# EAGLE design Anand1-BottomNew (EAGLE 9.5.2)
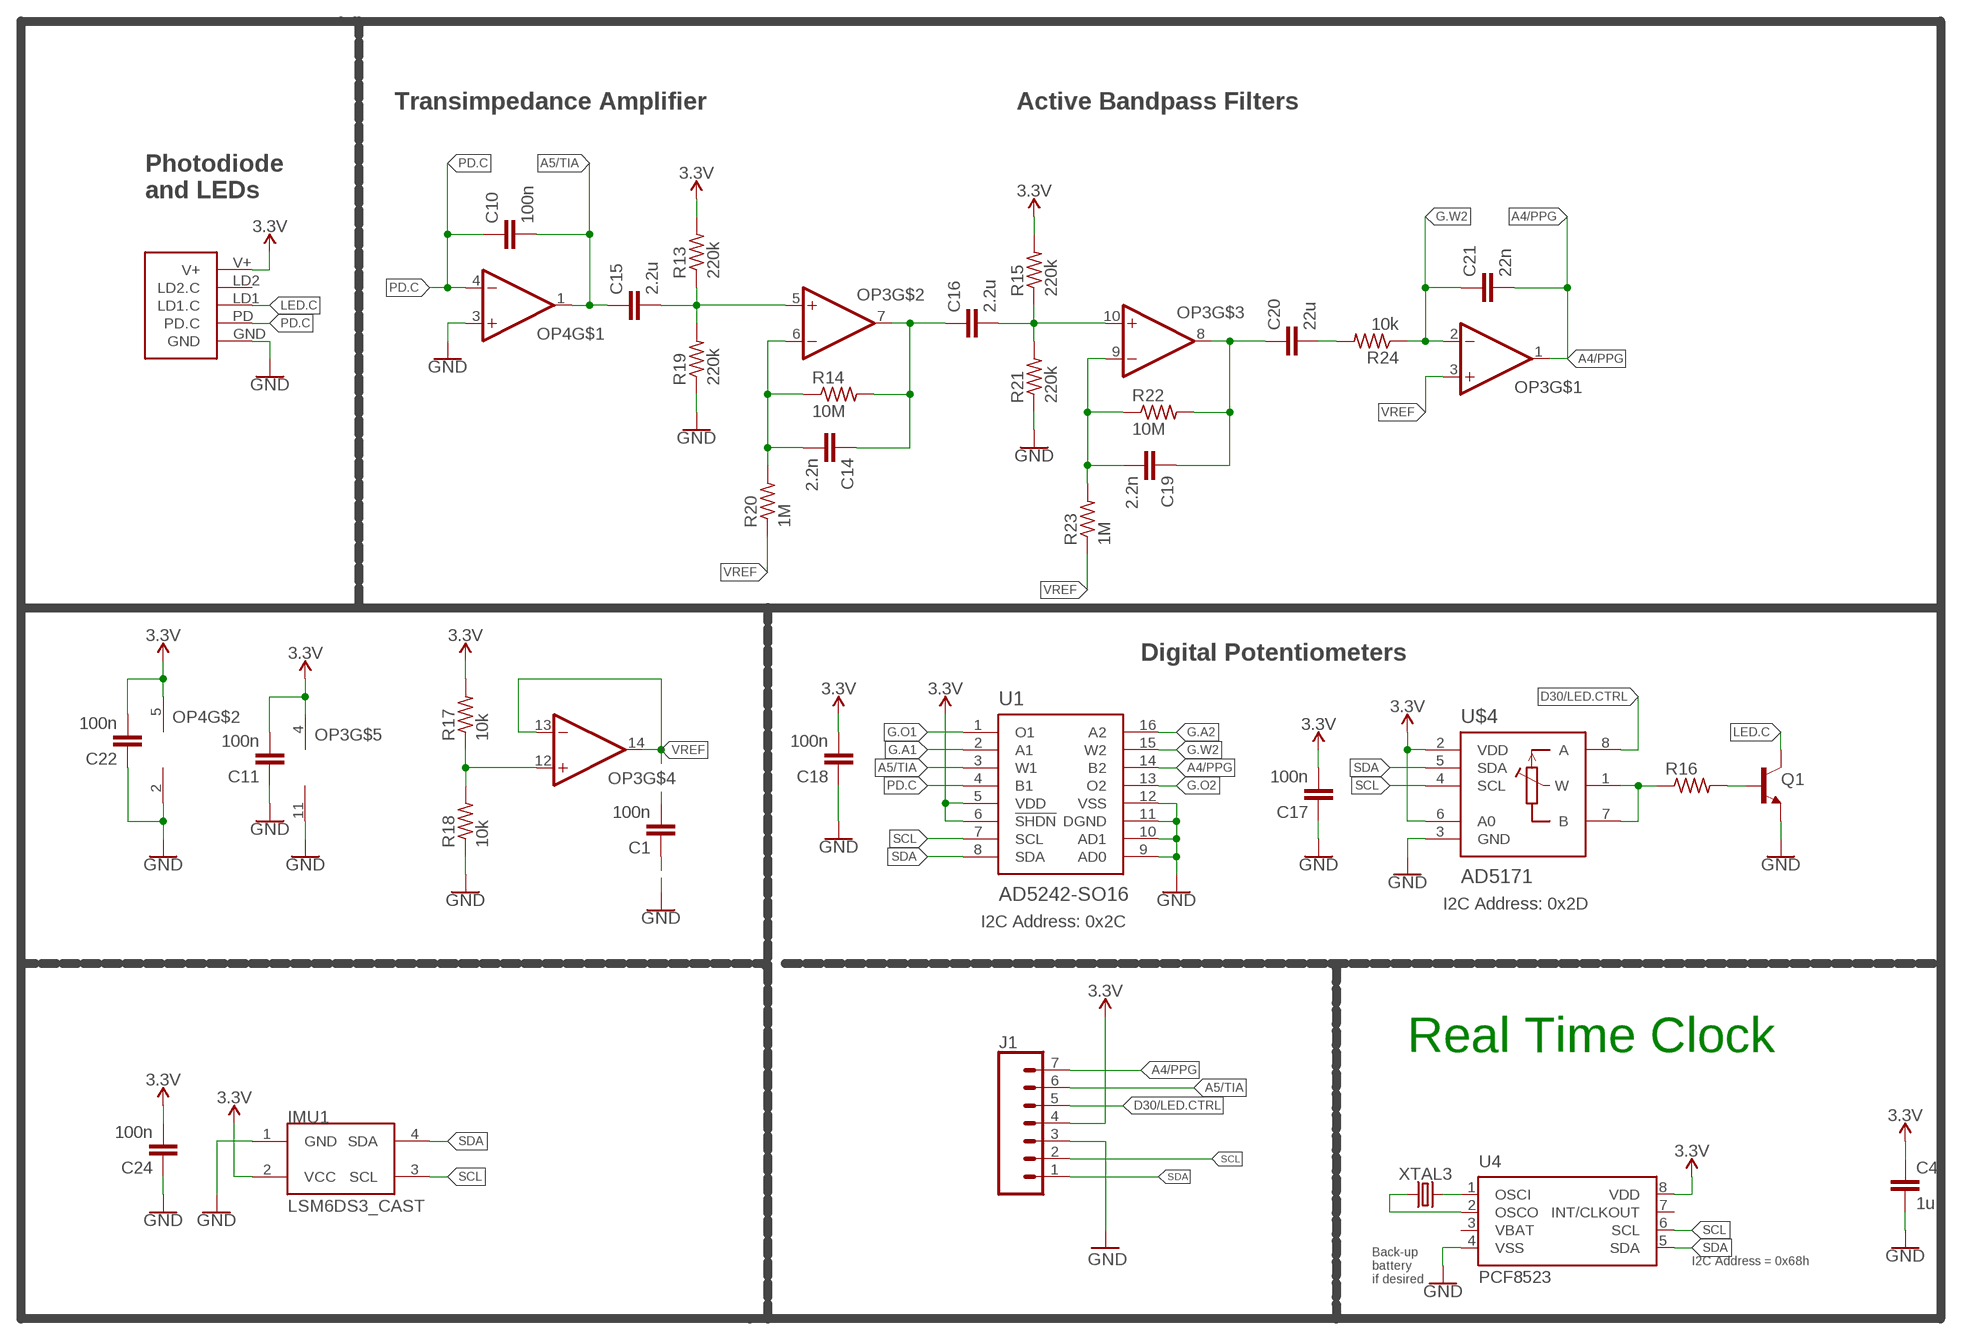
[diagram p0: schematic, sheet 1]

## Parts
C1  100n  CAPACITOR0603  [C0603]
C4  1u  CAPACITOR0603  [C0603]
C10  100n  CAPACITOR0603  [C0603]
C11  100n  CAPACITOR0603  [C0603]
C14  2.2n  CAPACITOR0603  [C0603]
C15  2.2u  CAPACITOR0603  [C0603]
C16  2.2u  CAPACITOR0603  [C0603]
C17  100n  CAPACITOR0603  [C0603]
C18  100n  CAPACITOR0603  [C0603]
C19  2.2n  CAPACITOR0603  [C0603]
C20  22u  CAPACITOR0603  [C0603]
C21  22n  CAPACITOR0603  [C0603]
C22  100n  CAPACITOR0603  [C0603]
C24  100n  CAPACITOR0603  [C0603]
IMU1  LSM6DS3_CAST  [LSM6DS3_CAST]
J1  CONN_07-1.27MM  [1X07_1.27MM]
OP3  OP-QUAD-SO14  [SO14]
OP4  OP-SINGLEOT  [SOT23-5]
Q1  NPN-GENERIC  [SOT23-3]
R13  220k  RESISTOR0603  [R0603]
R14  10M  RESISTOR0603  [R0603]
R15  220k  RESISTOR0603  [R0603]
R16  RESISTOR0603  [R0603]
R17  10k  RESISTOR0402  [R0402]
R18  10k  RESISTOR0402  [R0402]
R19  220k  RESISTOR0603  [R0603]
R20  1M  RESISTOR0603  [R0603]
R21  220k  RESISTOR0603  [R0603]
R22  10M  RESISTOR0603  [R0603]
R23  1M  RESISTOR0603  [R0603]
R24  10k  RESISTOR0603  [R0603]
U1  AD5242-SO16  [SO16]
U4  PCF8523  [SO8]
U$3  PPG.MODULE.2  [PPG.MODULE.2]
U$4  AD5171  [SOT-23-8]
XTAL3  32.7680kHz  CRYSTALECS-.327-12.5-12-C-TR  [2-SMD.NOLEAD.2.0MMTO1.2MM]

## Nets
3.3V: C4.1 C11.2 C17.2 C18.2 C22.2 C24.2 IMU1.2(VCC) J1.4 OP3.4(V+) OP4.5(V+) R13.2 R15.2 R17.2 U1.5(VDD) U1.6(!SHDN) U4.8(VDD) U$3.V+ U$4.2(VDD) U$4.6(A0)
A4/PPG: C21.2 J1.7 OP3.1(OUT) U1.14(B2)
A5/TIA: C10.2 C15.1 J1.6 OP4.1(OUT) U1.3(W1)
D30/LED.CTRL: J1.5 U$4.8(A)
G.A1: U1.2(A1)
G.A2: U1.16(A2)
G.O1: U1.1(O1)
G.O2: U1.13(O2)
G.W2: C21.1 OP3.2(-IN) R24.1 U1.15(W2)
GND: C1.1 C4.2 C11.1 C17.1 C18.1 C22.1 C24.1 IMU1.1(GND) J1.3 OP3.11(V-) OP4.2(V-) OP4.3(+IN) Q1.2(E) R18.1 R19.1 R21.1 U1.9(AD0) U1.10(AD1) U1.11(DGND) U1.12(VSS) U4.4(VSS) U$3.GND U$4.3(GND)
LED.C: Q1.3(C) U$3.LD1(LD1.C)
N$2: U4.2(OSCO) XTAL3.P$1
N$3: U4.1(OSCI) XTAL3.P$2
N$8: Q1.1(B) R16.2
N$9: R16.1 U$4.1(W) U$4.7(B)
N$10: OP3.12(+IN) R17.1 R18.2
N$13: C15.2 OP3.5(+IN) R13.1 R19.2
N$15: C14.2 OP3.6(-IN) R14.1 R20.2
N$16: C14.1 C16.1 OP3.7(OUT) R14.2
N$17: C16.2 OP3.10(+IN) R15.1 R21.2
N$18: C19.2 OP3.9(-IN) R22.1 R23.2
N$19: C19.1 C20.1 OP3.8(OUT) R22.2
N$20: C20.2 R24.2
PD.C: C10.1 OP4.4(-IN) U1.4(B1) U$3.PD(PD.C)
SCL: IMU1.3(SCL) J1.2 U1.7(SCL) U4.6(SCL) U$4.4(SCL)
SDA: IMU1.4(SDA) J1.1 U1.8(SDA) U4.5(SDA) U$4.5(SDA)
VREF: C1.2 OP3.3(+IN) OP3.13(-IN) OP3.14(OUT) R20.1 R23.1
Unconnected: U4.7(INT/CLKOUT) U$3.LD2(LD2.C)

## Notes on the sheet
- Transimpedance Amplifier | Active Bandpass Filters
- Photodiode
  and LEDs
- Digital Potentiometers
- I2C Address: 0x2D
- I2C Address: 0x2C
- Real Time Clock
- I2C Address = 0x68h
- Back-up
  battery
  if desired

## Power pins joined to a net without a drawn wire
VBAT: U4.3(VBAT)

## Library data of the parts
C1 C4 C10 C11 C14-C22 C24 = LinnesLab-Passives:CAPACITOR
IMU1 = LinnesLab-Sensors:LSM6DS3_CAST
J1 = LinnesLab-Connectors:CONN_07: Multi connection point. Often used as Generic Header-pin footprint for 0.1 inch spaced/style header connections On any of the 0.1 inch spaced packages, you can populate with these: Break Away Headers - Straight <https://www.sparkfun.com/products/116> (PRT-00116) Break Away Male Headers - Right Angle <https://www.sparkfun.com/products/553> (PRT-00553) Female Headers <https://www.sparkfun.com/products/115> (PRT-00115) Break Away Headers - Machine Pin <https://www.sparkfun.com/products/117> (PRT-00117) Break Away Female Headers - Swiss Machine Pin <https://www.sparkfun.com/products/743> (PRT-00743) For SCREWTERMINALS and SPRING TERMINALS visit here: Screw Terimnals on SparkFun.com <https://www.sparkfun.com/search/results?term=Screw+Terminals> (5mm/3.5mm/2.54mm spacing) This device is also useful as a general connection point to wire up your design to another part of your project. Our various solder wires solder well into these plated through hole pads. Hook-Up Wire - Assortment (Stranded, 22 AWG) <https://www.sparkfun.com/products/11375> (PRT-11375) Hook-Up Wire - Assortment (Solid Core, 22 AWG) <https://www.sparkfun.com/products/11367> (PRT-11367) View the entire wire category on our website here <https://www.sparkfun.com/categories/141> Special notes: Molex polarized connector foot print use with SKU : PRT-08231 with associated crimp pins and housings. 1MM SMD Version SKU: PRT-10208 NOTES ON THE VARIANTS LOCK and LOCK_LONGPADS... This footprint was designed to help hold the alignment of a through-hole component (i.e. 6-pin header) while soldering it into place. You may notice that each hole has been shifted either up or down by 0.005 of an inch from it's more standard position (which is a perfectly straight line). This slight alteration caused the pins (the squares in the middle) to touch the edges of the holes. Because they are alternating, it causes a "brace" to hold the component in place. 0.005 has proven to be the perfect amount of "off-center" position when using our standard breakaway headers. Although looks a little odd when you look at the bare footprint, once you have a header in there, the alteration is very hard to notice. Also,if you push a header all the way into place, it is covered up entirely on the bottom side.
OP3 = LinnesLab-AnalogIC:OP-QUAD: General symbol and footprints for Quad Op Amps. Use with any standard general purpose op amp.
OP4 = LinnesLab-AnalogIC:OP-SINGLE: Single Op Amp 2.7V to 6.0V Single Supply CMOS Source: http://ww1.microchip.com/downloads/en/DeviceDoc/21314g.pdf
Q1 = LinnesLab-DiscreteSemi:NPN
R13-R24 = LinnesLab-Passives:RESISTOR
U1 = LinnesLab-DigitalIC:AD5242
U4 = LinnesLab-Clocks:PCF8523; DIGIKEY: 568-5306-1-ND; I2C_ADDRESS: 0x68h; MFN: PCF8523T/1,118; MFN_MANUFACTURER: NXP USA Inc.
U$3 = LinnesLab-Connectors:PPG.MODULE.2: Digi-Key Part Number: S9014E-50-ND Manufacturer Part Number: GRPB501VWVN-RC Description: 1mm insulation height 0.05in pitch 50 positions
U$4 = LinnesLab-DigitalIC:AD5171
XTAL3 = LinnesLab-Clocks:CRYSTAL

## Board
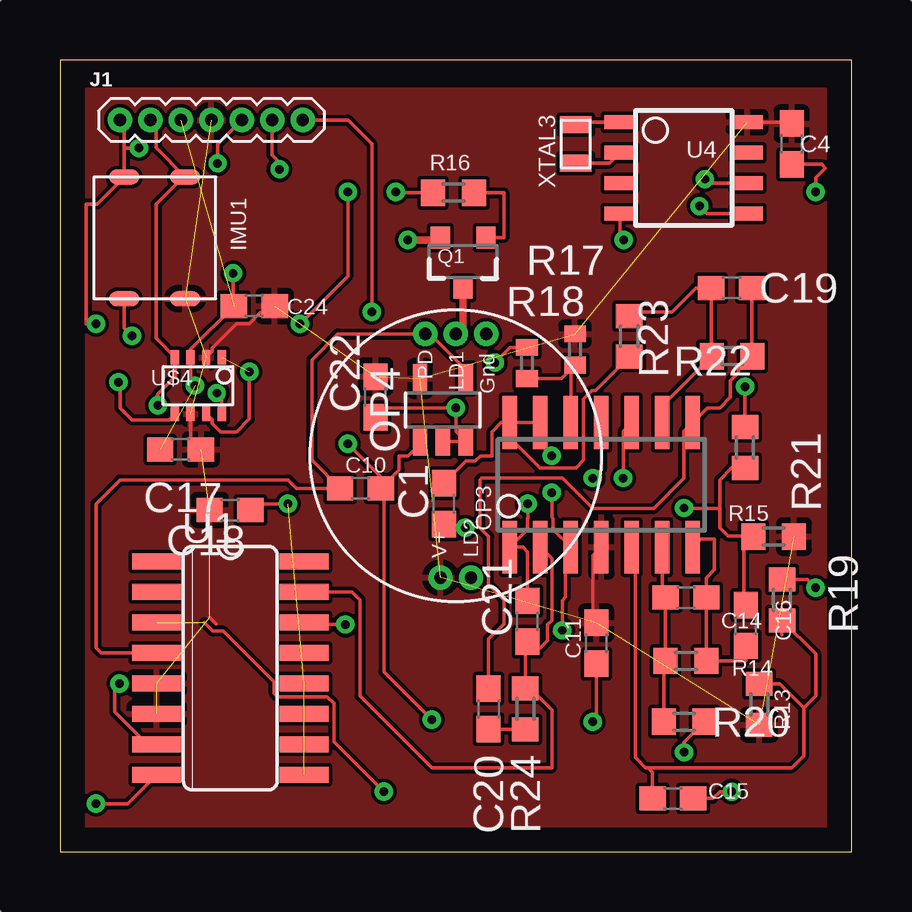
[diagram p1: board, top side]
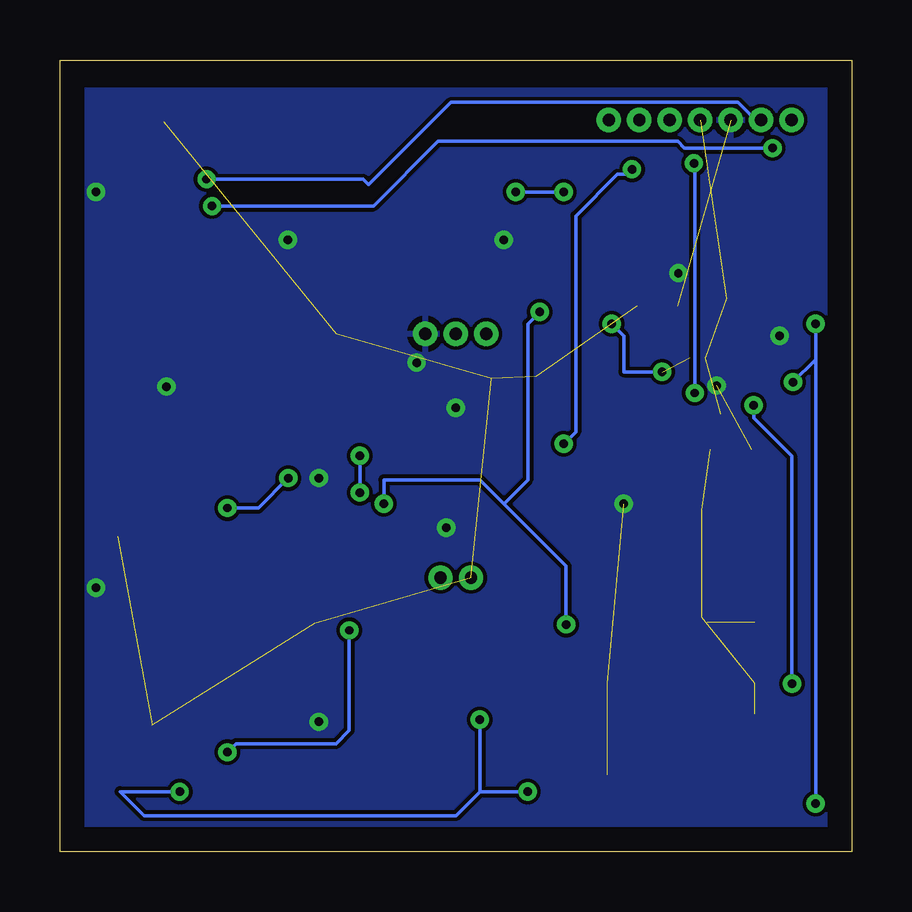
[diagram p2: board, bottom side, seen from below]

Size 33 x 33 mm. Coordinates in mm from the lower left corner, seen from the top.
Outline: 0,0 33,0 33,33 0,33 0,0
Copper layers (1*16): Top 0.035mm / dielectric 1.5mm / Bottom 0.035mm
Design rules "default": minimum track width 6mil, minimum drill 0.35mm, track to track 6mil, track to pad 6mil, pad to pad 6mil, via to via 6mil, smd to smd 6mil, copper to edge 40mil, drill to drill 6mil, minimum pad ring 10mil, minimum via ring 8mil, stop-mask expansion 4mil, vias tented up to drill 0mil, thermal gap 10mil

### Footprints (pad centres in the part's own frame; a part is rotated, then mirrored left to right if it is on the bottom)
C0603 = smd 1.1 x 1: 1 -0.85,0; 2 0.85,0
LSM6DS3_CAST = smd 0.635 x 1.27: 1 -2.54,1.27; 2 -2.54,-1.27; 3 2.54,-1.27; 4 2.54,1.27
1X07_1.27MM = drill 0.508 pad 1: 1 0,0; 2 1.27,0; 3 2.54,0; 4 3.81,0; 5 5.08,0; 6 6.35,0; 7 7.62,0
SO14 = smd 0.6 x 2.2: 1 -3.81,-2.6; 2 -2.54,-2.6; 3 -1.27,-2.6; 4 0,-2.6; 5 1.27,-2.6; 6 2.54,-2.6; 7 3.81,-2.6; 8 3.81,2.6; 9 2.54,2.6; 10 1.27,2.6; 11 0,2.6; 12 -1.27,2.6; 13 -2.54,2.6; 14 -3.81,2.6
SOT23-5 = smd 0.6 x 1.2: 1 -0.95,-1.306; 2 0,-1.306; 3 0.95,-1.306; 4 0.95,1.306; 5 -0.95,1.306
SOT23-3 = smd 0.8 x 0.9: 1 -0.95,-1; 2 0.95,-1; 3 0,1.1
R0603 = smd 1 x 1.1: 1 -0.85,0; 2 0.85,0
R0402 = smd 0.7 x 0.9: 1 -0.65,0; 2 0.65,0
SO16 = smd 0.66 x 2.032: 1 -4.445,-3.073; 2 -3.175,-3.073; 3 -1.905,-3.073; 4 -0.635,-3.073; 5 0.635,-3.073; 6 1.905,-3.073; 7 3.175,-3.073; 8 4.445,-3.073; 9 4.445,3.073; 10 3.175,3.073; 11 1.905,3.073; 12 0.635,3.073; 13 -0.635,3.073; 14 -1.905,3.073; 15 -3.175,3.073; 16 -4.445,3.073
SO8 = smd 1.3 x 0.6: 1 -2.65,1.905; 2 -2.65,0.635; 3 -2.65,-0.635; 4 -2.65,-1.905; 5 2.65,-1.905; 6 2.65,-0.635; 7 2.65,0.635; 8 2.65,1.905
PPG.MODULE.2 = drill 0.508 pad 0.94: GND 1.27,5.08; LD1 0,5.08; LD2 0.635,-5.08; PD -1.27,5.08; V+ -0.635,-5.08
SOT-23-8 = smd 0.35 x 0.6: 1 -0.991,-1.176; 2 -0.341,-1.176; 3 0.309,-1.176; 4 0.959,-1.176; 5 0.959,1.176; 6 0.309,1.176; 7 -0.341,1.176; 8 -0.991,1.176
2-SMD.NOLEAD.2.0MMTO1.2MM = smd 0.7 x 1.3: P$1 -0.8,0; P$2 0.8,0

### Placement (x,y rotation side)
C1  16,14.5 90 top
C4  30.5,29.5 270 top
C10  12.53,15.14 0 top
C11  22.36,8.69 90 top
C14  26.1,10.59 180 top
C15  25.55,2.21 180 top
C16  28.59,9.42 90 top
C17  5.03,16.77 0 top
C18  7.09,14.24 180 top
C19  28,23.5 180 top
C20  17.86,5.95 270 top
C21  19.49,9.6 90 top
C22  13.15,18.95 90 top
C24  8.1,22.75 0 top
IMU1  3.95,25.58 90 top
J1  2.5,30.5 0 top
OP3  22.57,15.29 0 top
OP4  15.96,18.41 0 top
Q1  16.81,24.6 180 top
R13  29.15,6.14 270 top
R14  26.1,7.95 0 top
R15  29.75,13.13 0 top
R16  16.4,27.46 0 top
R17  21.47,20.93 90 top
R18  19.47,20.37 270 top
R19  30.1,10.49 270 top
R20  26.02,5.41 180 top
R21  28.56,16.84 270 top
R22  28.02,20.65 0 top
R23  23.73,21.48 90 top
R24  19.4,5.95 270 top
U1  7.1,7.65 270 top
U4  26,28.5 0 top
U$3  16.5,16.5 0 top
U$4  5.75,19.42 180 top
XTAL3  21.5,29.5 90 top

### Tracks (layer width: path | path; a pad name or v marks a point on that pad's centre or on a via)
3.3V  (15 unrouted)
  Top 0.152: C11.2 22.21,9.69 22.21,12.34 OP3.4 | 6.24,9.76 6.5,9.5 | C24.2 8.95,22.47 8.34,22.47 7.9,22.02 7.37,22.02 6.34,21 6.34,20.85 U$4.2 | U4.8 30.45,30.41 C4.1 | C17.2 5.45,17.2 U$4.6
  pour Top: 0.04,31.79 32.79,31.79 32.79,0.04 0.04,0.04
A4/PPG  (via drill 0.35)
  Top 0.152: C21.2 19.49,12.49 19.5,12.5 19.31,12.69 OP3.1 19.5,13.43 19.5,13.89 v19.5,14.5 | v13,22.5 13,29.5 12,30.5 J1.7 | v11.89,9.46 10.26,9.46 U1.14
  Bottom 0.152: 14.5,14.5 15.5,15.5 19.5,15.5 v19.5,14.5 | v13,22.5 13.5,22 13.5,15.5 14.5,14.5 | 14.5,14.5 11.9,11.9 11.9,9.46 v11.89,9.46
A5/TIA  (via drill 0.35)  (1 unrouted)
  Top 0.152: OP4.1 15.01,17.01 14.5,16.5 14.14,16.5 14.14,15.91 C10.2 | C10.2 13.5,15.02 13.5,7.5 v15.5,5.5 | v28,2.5 27.5,2.5 27.22,2.21 C15.1 | v13.5,2.5 11.42,4.58 11.42,6.17 11.13,6.45 9.06,6.45 8.93,6.59 8.93,7.07 6.8,9.2 6.37,9.2 6.02,9.55 | 9.23,28.52 v9.15,28.44 9.15,28.72 8.83,29.04 8.85,29.05 J1.6 | v12,17 13.38,15.62 C10.2
  Bottom 0.152: v15.5,5.5 15.5,2.5 | 15.5,2.5 16.5,1.5 29.5,1.5 30.5,2.5 v28,2.5 | 15.5,2.5 v13.5,2.5 | v9.15,28.44 9.35,28.24 9.76,28.24 11.5,26.5 11.5,17.5 v12,17
D30/LED.CTRL  (via drill 0.35)
  Top 0.152: U$4.8 6.74,18.91 v6.54,19.11 | v6.57,28.69 6.57,29.49 J1.5
  Bottom 0.152: v6.54,19.11 6.54,28.66 v6.57,28.69
G.W2
  Top 0.152: C21.1 | R24.1 19.5,6.9 20.5,5.9 20.5,3.5 15.5,3.5 12.5,6.5 12.5,10.5 12.18,10.82 U1.15 | C21.1 19.62,8.62 | 19.62,8.62 19.74,8.5 20.03,8.5 20.33,8.81 20.33,9.47 20.5,9.64 20.5,12.22 OP3.2 | 19.4,8.4 19.62,8.62 | 19.23,6.8 R24.1 | R24.1 19.4,8.66 C21.1
GND  (via drill 0.35)  (6 unrouted)
  Top 0.152: OP3.11 22.57,15.93 v22.21,15.57 | R21.1 v28.56,19.38 | C11.1 22.36,5.56 v22.21,5.41 | v18.13,20.38 18.77,21.02 R18.1 | C18.1 8.2,14.5 v9.5,14.5 | C22.1 13.55,18.5 v16.5,18.5 16.5,17.51 OP4.3 OP4.2 | IMU1.1 2.68,21.82 v3,21.5 | 7.25,22.51 C24.1 | 7.25,22.64 C24.1 | R19.1 31.16,11.34 v31.5,11 | C24.1 5.45,20.94 U$4.3 5.45,19.6 v5.63,19.42 | v7.22,24.11 7.22,22.78 C24.1 | C1.1 16.15,13.5 v16.89,13.5 17,13.5 | C4.2 31.76,28.65 31.91,28.5 31.5,28.09 v31.5,27.5 | U4.4 23.35,25.65 v23.5,25.5
  Top 0.305: Q1.2 15.76,25.5 v14.5,25.5
  pour Bottom: 0.04,31.79 32.79,31.79 32.79,0.04 0.04,0.04
LED.C
  Top 0.305: Q1.3 16.81,21.89 U$3.LD1
N$2
  Top 0.152: XTAL3.P$1 22.91,28.7 U4.2
N$3
  Top 0.152: XTAL3.P$2 21.61,30.41 U4.1
N$8
  Top 0.152: R16.2 18.5,27.46 18.5,25.6 Q1.1
N$9  (via drill 0.35)  (1 unrouted)
  Top 0.152: 6.1,18.53 U$4.7 6.34,18 6.34,17.85 6.71,17.49 7.36,17.49 7.89,18.03 v7.89,20 | v14,27.5 14.02,27.5 14.05,27.46 R16.1 | v10,22 12,24 v12,27.5
  Bottom 0.152: v14,27.5 v12,27.5 | v10,22 9.5,21.5 9.5,20 v7.89,20
N$10
  Top 0.152: OP3.12 21.3,20.1 R17.1 20.91,19.72 R18.2
N$13
  Top 0.152: C15.2 24.36,2.21 | OP3.5 23.98,12.55 23.98,3.93 24.41,3.5 24.5,3.5 | R19.2 30.1,9.04 | C15.2 25.03,1.88 | R19.2 29.68,9.22 | 24.5,3.5 30.5,3.5 31,4 31,6 | R13.1 30.01,6.99 31,6 | R19.2 31.5,8.24 31.5,6.5 31,6 | 24.5,3.5 24.7,3.3 C15.2
N$15
  Top 0.152: 25.23,5.35 R20.2 25.17,7.87 R14.1 C14.2 25.11,10.73 OP3.6
N$16
  Top 0.152: 26.38,12.67 OP3.7 26.71,13.03 27.29,13.03 27.29,11.76 26.95,11.42 C14.1 R14.2 28.59,7.95 C16.1
N$17  (via drill 0.35)
  Top 0.152: 27.5,14.3 26.02,14.3 v26.02,14.32 | R15.1 28.88,13.19 28.84,13.16 | v23.48,15.57 23.48,17.54 OP3.10 | C16.2 28.5,10.36 28.5,12.81 28.84,13.16 | 27.5,14.3 27.5,13.5 27.84,13.16 28.84,13.16 | 27.5,14.3 27.5,15.5 27.99,15.99 R21.2
  Bottom 0.152: v26.02,14.32 24.73,14.32 v23.48,15.57
N$18
  Top 0.152: OP3.9 25.11,18.59 R22.1 27.15,20.67 C19.2 26.5,23.5 25.5,22.5 23.9,22.5 R23.2
N$19
  Top 0.152: OP3.8 26.02,17.54 26.02,15.57 24.75,14.3 22.21,14.3 20.94,15.57 17.57,15.57 17.5,15.5 17.5,13.5 17.87,13.13 17.87,11.13 18.5,10.5 18.5,9.5 17.86,8.86 C20.1 17.5,7.16 | 29.29,20.65 R22.2 | C19.1 28.85,20.67 R22.2 | OP3.8 26.59,18.11 | OP3.8 26.38,18.47 | OP3.8 26.98,18.5 27.5,18.5 27.95,18.95 27.95,19.63 28.29,19.97 28.29,20.07 R22.2
N$20
  Top 0.152: R24.2 C20.2
PD.C
  Top 0.152: OP4.4 16.91,20.09 15.42,21.58 U$3.PD 11.58,21.58 10.5,20.5 10.5,16.32 C10.1 9.86,15.14 9.5,15.5 2.5,15.5 1.5,14.5 1.5,8.5 1.72,8.28 U1.4
SCL  (via drill 0.35)
  Top 0.152: v4.08,18.61 4.08,18.58 4,18.5 4,18.95 4.07,19.02 4.07,19.07 4.79,19.8 U$4.4 4,21.4 4,26.98 5.14,28.12 IMU1.3 4,29.34 4,30.27 J1.2 | v2.48,7 2.28,6.8 2.28,5.82 3.5,4.6 3.5,4.5 3.53,4.47 U1.7 | U4.6 27.05,27.86 v26.89,28.03
  Bottom 0.152: v4.08,18.61 4.08,18.08 2.5,16.5 2.5,7 v2.48,7 | v26.89,28.03 20.36,28.03 20.13,27.8 16.7,31.24 4.74,31.24 4,30.5 J1.2
SDA  (via drill 0.35)
  Top 0.152: J1.1 2.68,30.32 2.68,29.38 | 2.68,29.38 IMU1.4 1.56,27 1.09,27 1.09,22 v1.5,22 | v1.5,2 2.83,2 U1.8 | U$4.5 4.55,18 3,18 2.5,18.5 2.5,19.51 v2.44,19.57 | U4.5 26.98,26.59 v26.66,26.91 | v3.29,29.33 2.73,29.33 2.68,29.38
  Bottom 0.152: v1.5,22 1.5,20.5 | 1.5,20.5 v1.5,2 | v2.44,19.57 1.51,20.5 1.5,20.5 | v26.66,26.91 19.93,26.91 17.23,29.61 7.25,29.61 6.97,29.33 v3.29,29.33
VREF  (via drill 0.35)
  Top 0.152: R20.1 26.02,4.56 v26.02,4.14 | v20.94,9.22 20.94,10.48 21.07,10.61 21.07,12.47 OP3.3 20.55,13.43 20.55,13.89 20.5,13.94 v20.5,14.96 20.5,15 | R23.1 22.32,19.22 22.17,19.22 21.82,18.87 21.82,16.32 21.5,16 20,16 18.76,17.24 OP3.14 | OP3.14 OP3.13 20.03,16.97 v20.5,16.5 | C1.2 16.93,16.27 17.3,16.27 17.53,16.5 18,16.5 18,17.5 18.39,17.89 OP3.14
  Bottom 0.152: v20.94,9.22 20.94,5.06 21.5,4.5 25.66,4.5 v26.02,4.14 | v20.5,14.96 v20.5,16.5